# Altium schematic sheet Connector.SchDoc
size A4
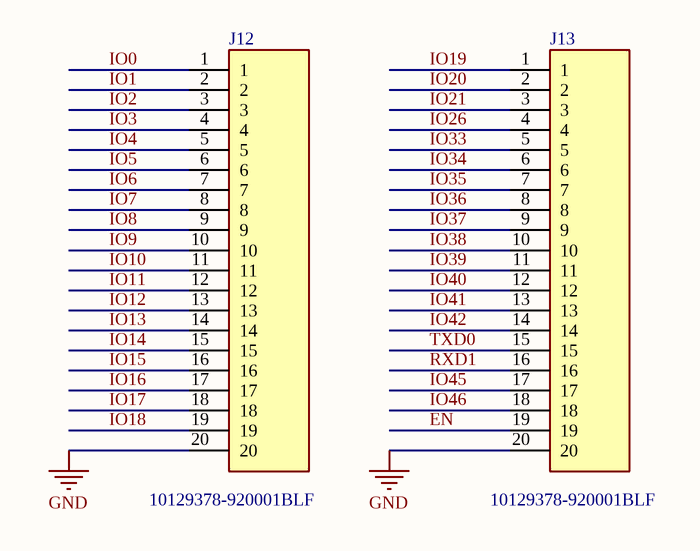
[diagram p0: Connector.SchDoc]

## Parts
J12  10129378-920001BLF  [HDRV20W67P0X254_1X20_5080X241X858P]
J13  10129378-920001BLF  [HDRV20W67P0X254_1X20_5080X241X858P]

## Nets
GND: J12.20 J13.20
EN: J13.19
IO0: J12.1
IO1: J12.2
IO2: J12.3
IO3: J12.4
IO4: J12.5
IO5: J12.6
IO6: J12.7
IO7: J12.8
IO8: J12.9
IO9: J12.10
IO10: J12.11
IO11: J12.12
IO12: J12.13
IO13: J12.14
IO14: J12.15
IO15: J12.16
IO16: J12.17
IO17: J12.18
IO18: J12.19
IO19: J13.1
IO20: J13.2
IO21: J13.3
IO26: J13.4
IO33: J13.5
IO34: J13.6
IO35: J13.7
IO36: J13.8
IO37: J13.9
IO38: J13.10
IO39: J13.11
IO40: J13.12
IO41: J13.13
IO42: J13.14
IO45: J13.17
IO46: J13.18
RXD1: J13.16
TXD0: J13.15

## Library data of the parts
J12 J13 = 10129378-920001BLF: Connector; Manufacturer_Name: Amphenol; Datasheet Link: https://cdn.amphenol-icc.com/media/wysiwyg/files/drawing/10129378.pdf; Height: 8.58mm; Manufacturer_Part_Number: 10129378-920001BLF